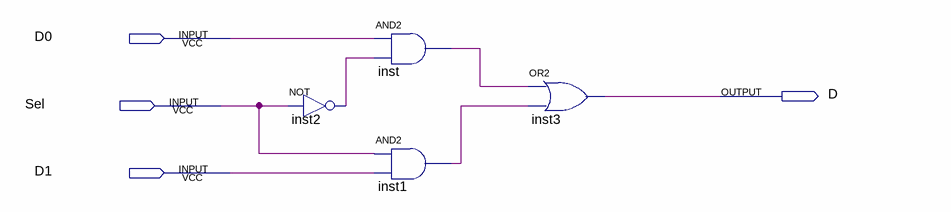
[diagram p0: schematic sheet]
// Quartus schematic MUX21.bdf as structural Verilog: 4 symbols, 4 pins
module MUX21 (
  input  D0,
  input  Sel,
  input  D1,
  output D
);

  wire inst1_out, inst2_out, inst_out;

  not inst2 (inst2_out, Sel);
  and inst (inst_out, D0, inst2_out);
  and inst1 (inst1_out, Sel, D1);
  or inst3 (D, inst_out, inst1_out);
endmodule
